# EAGLE design Siren (EAGLE 7.7.0)
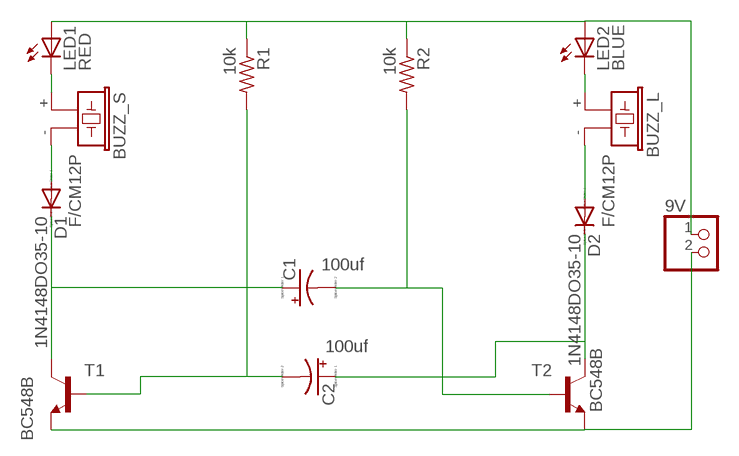
[diagram p0: schematic, sheet 1]

## Parts
9V  PINHD-1X2  [1X02]
BUZZ_L  F/CM12P  [F/CM12P]
BUZZ_S  F/CM12P  [F/CM12P]
C1  100uf  CPOL-USE2.5-5  [E2,5-5]
C2  100uf  CPOL-USE2.5-5  [E2,5-5]
D1  1N4148DO35-10  [DO35-10]
D2  1N4148DO35-10  [DO35-10]
LED1  RED  LED5MM  [LED5MM]
LED2  BLUE  LED5MM  [LED5MM]
R1  10k  R-US_0204/7  [0204/7]
R2  10k  R-US_0204/7  [0204/7]
T1  BC548B  BC548-NPN-TO92-CBE  [TO92-CBE]
T2  BC548B  BC548-NPN-TO92-CBE  [TO92-CBE]

## Nets
N$1: BUZZ_S.+ LED1.K(C)
N$2: BUZZ_S.- D1.A
N$3: C1.+ D1.C T1.C
N$4: 9V.2 T1.E T2.E
N$5: BUZZ_L.+ LED2.K(C)
N$6: BUZZ_L.- D2.A
N$7: C2.+ D2.C T2.C
N$9: C2.- R1.2 T1.B
N$10: C1.- R2.2 T2.B
N$11: 9V.1 LED1.A LED2.A R1.1 R2.1

## Library data of the parts
9V = pinhead:PINHD-1X2: PIN HEADER
BUZZ_L BUZZ_S = buzzer:F/CM12P: BUZZER Source: Buerklin; OC_FARNELL: unknown; OC_NEWARK: unknown
C1 C2 = resistor:CPOL-US: POLARIZED CAPACITOR, American symbol
D1 D2 = diode:1N4148: DIODE high speed (Philips)
LED1 LED2 = led:LED: LED OSRAM: - CHIPLED LG R971, LG N971, LY N971, LG Q971, LY Q971, LO R971, LY R971 LH N974, LH R974 LS Q976, LO Q976, LY Q976 LO Q996 - Hyper CHIPLED LW Q18S LB Q993, LB Q99A, LB R99A - SideLED LS A670, LO A670, LY A670, LG A670, LP A670 LB A673, LV A673, LT A673, LW A673 LH A674 LY A675 LS A676, LA A676, LO A676, LY A676, LW A676 LS A679, LY A679, LG A679 - Hyper Micro SIDELED® LS Y876, LA Y876, LO Y876, LY Y876 LT Y87S - SmartLED LW L88C, LW L88S LB L89C, LB L89S, LG L890 LS L89K, LO L89K, LY L89K LS L896, LA L896, LO L896, LY L896 - TOPLED LS T670, LO T670, LY T670, LG T670, LP T670 LSG T670, LSP T670, LSY T670, LOP T670, LYG T670 LG T671, LOG T671, LSG T671 LB T673, LV T673, LT T673, LW T673 LH T674 LS T676, LA T676, LO T676, LY T676, LB T676, LH T676, LSB T676, LW T676 LB T67C, LV T67C, LT T67C, LS T67K, LO T67K, LY T67K, LW E67C LS E67B, LA E67B, LO E67B, LY E67B, LB E67C, LV E67C, LT E67C LW T67C LS T679, LY T679, LG T679 LS T770, LO T770, LY T770, LG T770, LP T770 LB T773, LV T773, LT T773, LW T773 LH T774 LS E675, LA E675, LY E675, LS T675 LS T776, LA T776, LO T776, LY T776, LB T776 LHGB T686 LT T68C, LB T68C - Hyper Mini TOPLED® LB M676 - Mini TOPLED Santana® LG M470 LS M47K, LO M47K, LY M47K Source: http://www.osram.convergy.de LUXEON: - LUMILED® LXK2-PW12-R00, LXK2-PW12-S00, LXK2-PW14-U00, LXK2-PW14-V00 LXK2-PM12-R00, LXK2-PM12-S00, LXK2-PM14-U00 LXK2-PE12-Q00, LXK2-PE12-R00, LXK2-PE12-S00, LXK2-PE14-T00, LXK2-PE14-U00 LXK2-PB12-K00, LXK2-PB12-L00, LXK2-PB12-M00, LXK2-PB14-N00, LXK2-PB14-P00, LXK2-PB14-Q00 LXK2-PR12-L00, LXK2-PR12-M00, LXK2-PR14-Q00, LXK2-PR14-R00 LXK2-PD12-Q00, LXK2-PD12-R00, LXK2-PD12-S00 LXK2-PH12-R00, LXK2-PH12-S00 LXK2-PL12-P00, LXK2-PL12-Q00, LXK2-PL12-R00 Source: www.luxeon.com KINGBRIGHT: KA-3528ASYC Source: www.kingbright.com
R1 R2 = resistor:R-US_: RESISTOR, American symbol
T1 T2 = transistor:*-NPN-: NPN Transistror BF959 corrected 2008.03.06

## Board
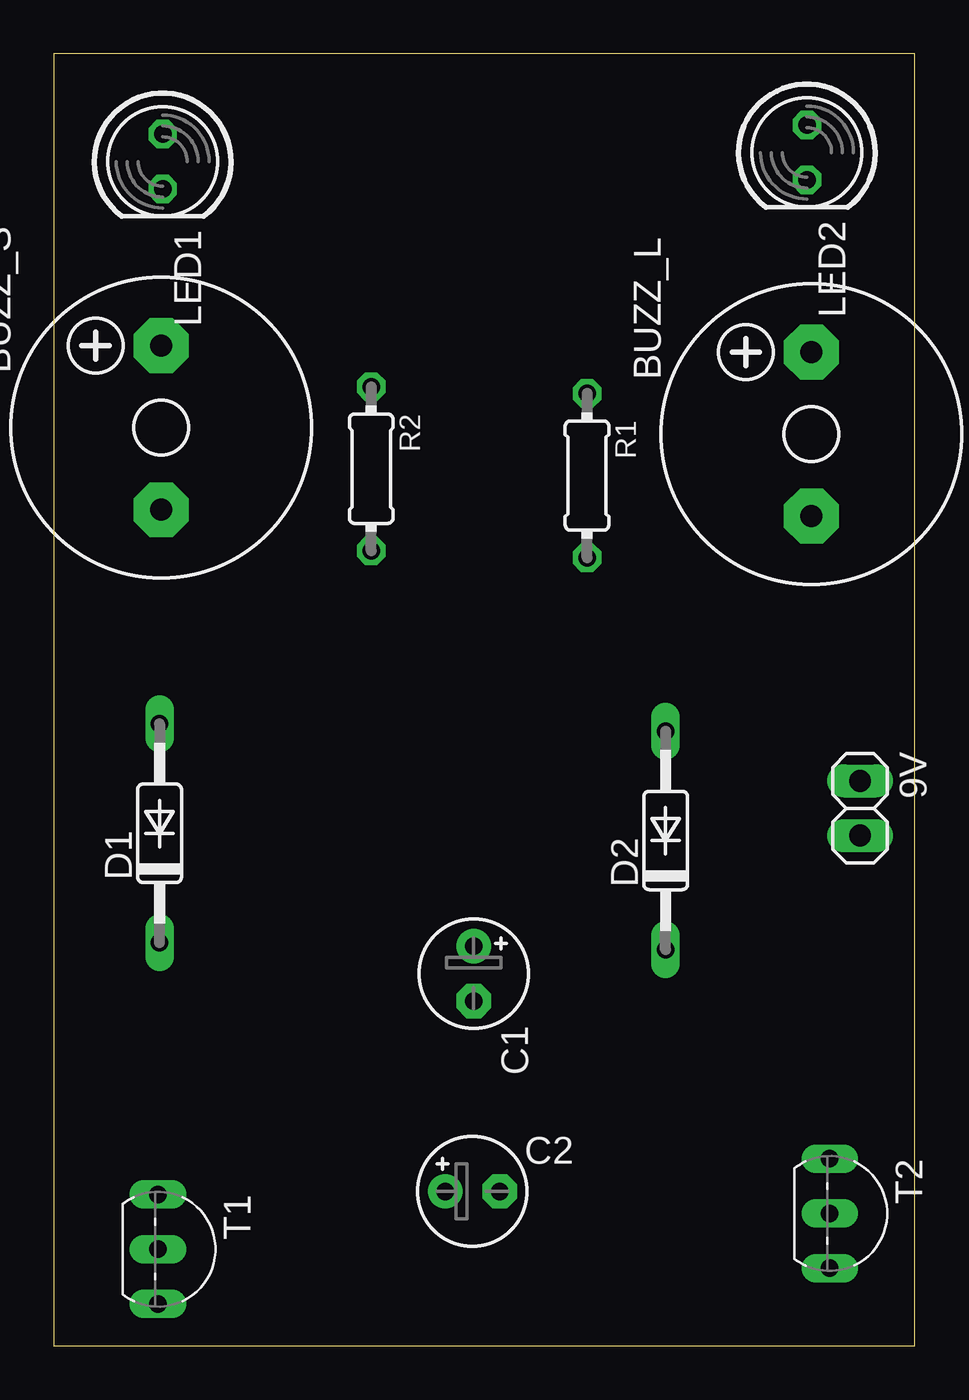
[diagram p1: board, top side]
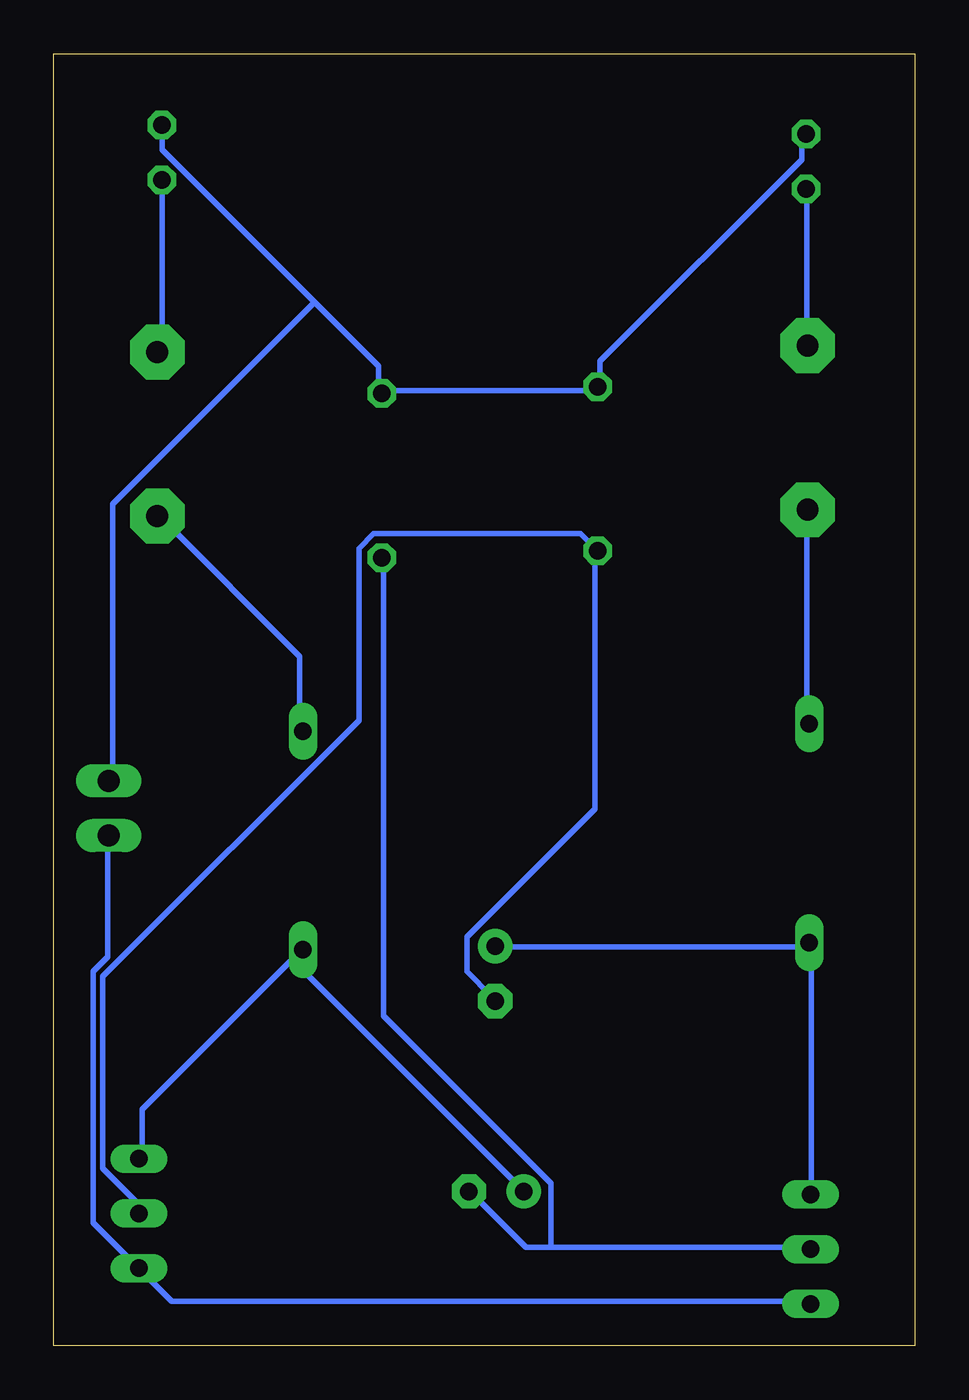
[diagram p2: board, bottom side, seen from below]

Size 40 x 60 mm. Coordinates in mm from the lower left corner, seen from the top.
Outline: 0,0 40,0 40,60 0,60 0,0
Copper layers (1*16): Top 0.035mm / dielectric 1.5mm / Bottom 0.035mm
Design rules "default": minimum track width 10mil, minimum drill 24mil, track to track 8mil, track to pad 8mil, pad to pad 8mil, via to via 8mil, smd to smd 8mil, copper to edge 40mil, drill to drill 8mil, minimum pad ring 10mil, minimum via ring 8mil, stop-mask expansion 4mil, vias tented up to drill 0mil, thermal gap 10mil

### Footprints (pad centres in the part's own frame; a part is rotated, then mirrored left to right if it is on the bottom)
1X02 = drill 1.016 long: 1 -1.27,0; 2 1.27,0
F/CM12P = drill 1.016 pad 2.54 octagon: + 3.81,0; - -3.81,0
E2,5-5 = drill 0.813 pad 1.6: + -1.27,0 | drill 0.813 pad 1.6 octagon: - 1.27,0
DO35-10 = drill 0.813 long: A 5.08,0; C -5.08,0
LED5MM = drill 0.813 octagon: A -1.27,0; K 1.27,0
0204/7 = drill 0.813 octagon: 1 -3.81,0; 2 3.81,0
TO92-CBE = drill 0.813 long: B 0,0; C -2.54,0; E 2.54,0

### Placement (x,y rotation side)
9V  37.45,24.96 270 top
BUZZ_L  35.19,42.34 90 top
BUZZ_S  4.98,42.64 90 top
C1  19.5,17.28 270 top
C2  19.44,7.17 0 top
D1  4.91,23.8 90 top
D2  28.42,23.46 90 top
LED1  5.06,55 270 top
LED2  34.98,55.42 270 top
R1  24.77,40.41 270 top
R2  14.74,40.73 270 top
T1  4.84,4.48 270 top
T2  36.05,6.14 270 top

### Tracks (layer width: path | path; a pad name or v marks a point on that pad's centre or on a via)
N$1
  Bottom 0.254: LED1.K 5.03,53.72 5.03,46.63 BUZZ_S.+
N$2
  Bottom 0.254: D1.A 5.03,29.03 5.03,38.63 BUZZ_S.-
N$3
  Bottom 0.254: T1.C 4.8,7.09 4.8,18.52 D1.C 5.03,18.52 19.43,18.52 C1.+
N$4
  Bottom 0.254: T1.E 5.03,2.06 34.52,2.06 35.89,3.43 T2.E 36.12,3.66 38.18,5.71 38.18,17.37 37.49,18.06 37.49,23.55 9V.2
N$5
  Bottom 0.254: LED2.K 34.98,53.95 34.98,46.18 BUZZ_L.+
N$6
  Bottom 0.254: D2.A 28.57,28.57 28.57,32 34.98,38.41 BUZZ_L.-
N$7
  Bottom 0.254: 28.8,18.06 28.57,18.29 D2.C 28.8,18.06 | 28.8,18.06 35.89,10.97 35.89,8.69 T2.C | 28.8,18.06 28.8,17.83 18.29,7.32 C2.+
N$9
  Bottom 0.254: 16.92,4.57 18.06,4.57 20.57,7.09 C2.- | 16.92,4.57 5.03,4.57 T1.B | 16.92,4.57 16.92,7.54 24.69,15.32 24.69,36.58 R1.2
N$10
  Bottom 0.254: C1.- 19.66,16.23 20.8,17.37 20.8,18.97 14.86,24.92 14.86,36.8 R2.2 14.86,37.03 15.54,37.72 25.15,37.72 25.83,37.03 25.83,29.03 37.72,17.14 37.72,8.23 36.12,6.63 36.12,6.17 T2.B
N$11
  Bottom 0.254: LED1.A 5.26,56.24 5.26,55.09 14.63,45.72 14.63,44.58 R2.1 14.86,44.35 24.69,44.35 R1.1 24.92,44.35 24.92,45.49 27.89,48.46 | 27.89,48.46 34.98,55.55 34.98,56.46 LED2.A | 27.89,48.46 37.26,39.09 37.26,26.29 9V.1